# EAGLE design uStar-V2 (EAGLE 9.6.2)
GLOBTEST: v555
Assembly variants: BaseSation, Flight

## Sheet 1 of 2
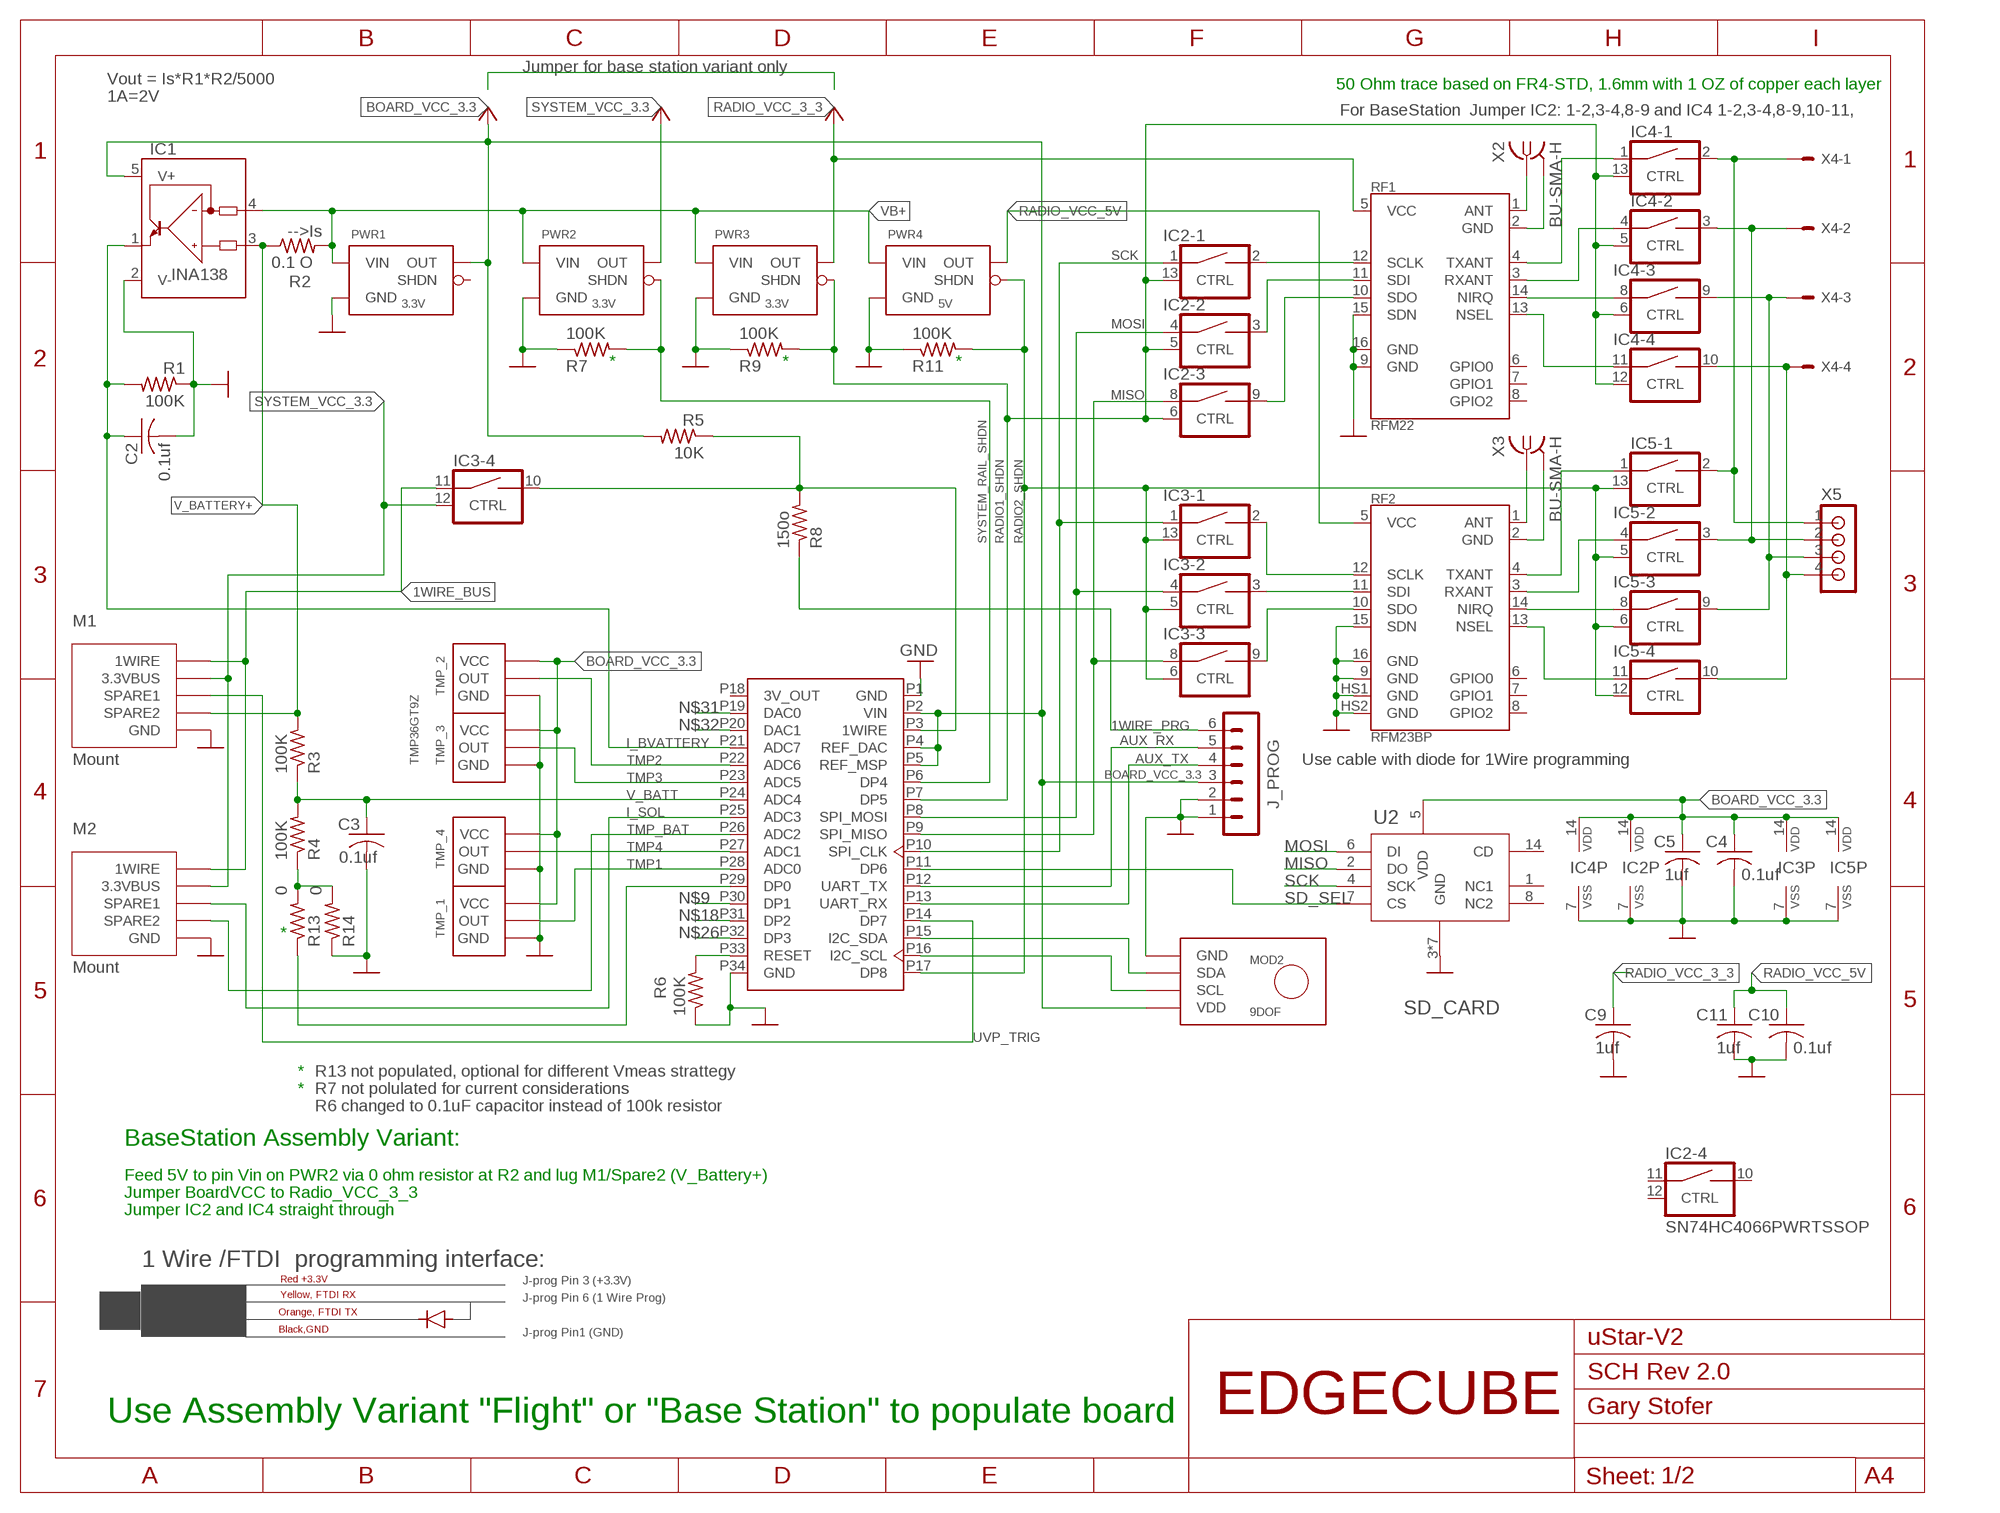
[diagram p0: schematic, sheet 1]
FRAME1 (SSEL_SHEET_A3): AUTHOR: Gary Stofer; DOC_NUMBER-VERSION: SCH Rev 2.0; SHEET_NAME: Main

### Parts
C2  0.1uf  C-USC0805  [C0805]  (not fitted in variant BaseSation)
C3  0.1uf  C-USC0805  [C0805]  (not fitted in variant BaseSation)
C4  0.1uf  C-USC0805  [C0805]
C5  1uf  C-USC0805  [C0805]
C9  1uf  C-USC0805  [C0805]
C10  0.1uf  C-USC0805  [C0805]
C11  1uf  C-USC0805  [C0805]
D1  1N4148DO35-7  [DO35-7]
IC1  INA138  [SOT23-5]  (not fitted in variant BaseSation)
IC2  SN74HC4066PWRTSSOP  [TSSOP14]  (not fitted in variant BaseSation)
IC3  SN74HC4066PWRTSSOP  [TSSOP14]  (not fitted in variant BaseSation)
IC4  SN74HC4066PWRTSSOP  [TSSOP14]  (not fitted in variant BaseSation)
IC5  SN74HC4066PWRTSSOP  [TSSOP14]  (not fitted in variant BaseSation)
J_PROG  90deg header  MA06-190DEG  [MA06-1-90]
M1  Mount  4X8MOUNT  [4X8MOUNT]
M2  Mount  4X8MOUNT  [4X8MOUNT]
MOD1  APP_CORE  [APPCORE_RECEIVER]
MOD2  9DOF  [9DOF]  (not fitted in variant BaseSation)
PWR1  3.3V  S7V8F3_VOLT_REG-3V3_1AUP  [S7V_UP]
PWR2  3.3V  S7V8F3_VOLT_REG-3V3_1AUP  [S7V_UP]  (not fitted in variant BaseSation)
PWR3  3.3V  S7V8F3_VOLT_REG-3V3_1AUP  [S7V_UP]  (not fitted in variant BaseSation)
PWR4  5V  S10V4F5UP  [S10_UP]  (not fitted in variant BaseSation)
R1  100K  R-US_R0805  [R0805]  (not fitted in variant BaseSation)
R2  0.1 O  R-US_R1206W  [R1206W]  (variant BaseSation: 0.0hm)
R3  100K  R-US_R0805  [R0805]  (not fitted in variant BaseSation)
R4  100K  R-US_R0805  [R0805]  (not fitted in variant BaseSation)
R5  10K  R-US_R0805  [R0805]
R6  100K  R-US_R0805  [R0805]  (not fitted in variant BaseSation)  (not fitted in variant Flight)
R7  100K  R-US_R0805  [R0805]  (not fitted in variant BaseSation)  (not fitted in variant Flight)
R8  150o  R-US_R0805  [R0805]
R9  100K  R-US_R0805  [R0805]  (not fitted in variant BaseSation)
R11  100K  R-US_R0805  [R0805]  (not fitted in variant BaseSation)
R13  0  R-US_R0805  [R0805]  (not fitted in variant BaseSation)  (not fitted in variant Flight)
R14  0  R-US_R0805  [R0805]  (not fitted in variant BaseSation)
RF1  RFM22  [RFM22]
RF2  RFM23BP  [RFM23BP]  (not fitted in variant BaseSation)
TMP_1  TMP3P  [TMP3P]  (not fitted in variant BaseSation)
TMP_2  TMP3P  [TMP3P]  (not fitted in variant BaseSation)
TMP_3  TMP36GT9Z  [TO92-INLINE]  (not fitted in variant BaseSation)
TMP_4  TMP3P  [TMP3P]  (not fitted in variant BaseSation)
U2  SD_CARD  503182-1852  [503182-1852_MOL]  (not fitted in variant BaseSation)
X2  BU-SMA-H  [BU-SMA-H]
X3  BU-SMA-H  [BU-SMA-H]  (not fitted in variant BaseSation)
X4  SM04B-SRSS-TB  [SM04B-SRSS-TB]
X5  4-TP  [1X04-1.5MM_JST]

### Nets
1WIRE: IC3.10(-4:B) MOD1.P3(1WIRE) R5.1 R8.2
1WIRE_BUS: IC3.11(-4:A) M1.P$2(1WIRE) M1.P$5(1WIRE) M2.P$2(1WIRE) M2.P$5(1WIRE)
1WIRE_PRG: J_PROG.6 R8.1
AUX_RX: J_PROG.5 MOD1.P12(UART_TX)
AUX_TX: J_PROG.4 MOD1.P13(UART_RX)
BOARD_VCC_3.3: C4.1 C5.1 IC1.5(V+) IC2.14(P:VDD) IC3.14(P:VDD) IC4.14(P:VDD) IC5.14(P:VDD) J_PROG.3 MOD1.P2(VIN) MOD1.P4(REF_DAC) MOD1.P5(REF_MSP) MOD2.VDD PWR1.VOUT(OUT) R5.2 TMP_1.P$3(VCC) TMP_2.P$3(VCC) TMP_3.1(VCC) TMP_4.P$3(VCC) U2.5(VDD) ; supply symbol labelled VCC
GND: C2.2 C3.2 C4.2 C5.2 C9.2 C10.2 C11.2 IC1.2(V-) IC2.7(P:VSS) IC3.7(P:VSS) IC4.7(P:VSS) IC5.7(P:VSS) J_PROG.1 J_PROG.2 M1.P$1(GND) M1.P$8(GND) M2.P$1(GND) M2.P$8(GND) MOD1.P1(GND) MOD1.P34(GND) MOD2.GND PWR1.GND PWR2.GND PWR3.GND PWR4.GND R1.1 R6.1 R7.1 R9.1 R11.1 R14.1 RF1.2(GND) RF1.9(GND) RF1.15(SDN) RF1.16(GND) RF2.2(GND) RF2.9(GND) RF2.15(SDN) RF2.16(GND) RF2.HS1(GND) RF2.HS2(GND) TMP_1.P$1(GND) TMP_2.P$1(GND) TMP_3.3(GND) TMP_4.P$1(GND) U2.3(GND) U2.9(GND) U2.10(GND) U2.11(GND) U2.12(GND) U2.13(GND) U2.15(GND) X2.2 X2.3 X2.4 X2.5 X3.2 X3.3 X3.4 X3.5
I_BVATTERY: C2.1 IC1.1(OUT) MOD1.P21(ADC7) R1.2
I_SOL: M2.P$6(SPARE1) MOD1.P25(ADC3)
MISO: IC2.8(-3:A) IC3.8(-3:A) MOD1.P9(SPI_MISO) U2.2(DO)
MOSI: IC2.4(-2:A) IC3.4(-2:A) MOD1.P8(SPI_MOSI) U2.6(DI)
N$1: MOD1.P16(I2C_SCL) MOD2.SCL
N$2: MOD1.P15(I2C_SDA) MOD2.SDA
N$3: RF1.1(ANT) X2.1
N$5: RF2.1(ANT) X3.1
N$6: IC5.8(-3:A) RF2.14(NIRQ)
N$7: MOD1.P29(DP0) R13.1
N$9: MOD1.P30(DP1)
N$10: IC2.2(-1:B) RF1.12(SCLK)
N$11: IC4.8(-3:A) RF1.14(NIRQ)
N$12: IC2.3(-2:B) RF1.11(SDI)
N$13: IC2.9(-3:B) RF1.10(SDO)
N$14: MOD1.P33(RESET) R6.2
N$15: IC3.2(-1:B) RF2.12(SCLK)
N$16: IC3.3(-2:B) RF2.11(SDI)
N$17: IC3.9(-3:B) RF2.10(SDO)
N$18: MOD1.P31(DP2)
N$19: IC4.9(-3:B) IC5.9(-3:B) X4.3 X5.3
N$20: IC5.11(-4:A) RF2.13(NSEL)
N$21: IC4.4(-2:A) RF1.3(RXANT)
N$22: IC4.10(-4:B) IC5.10(-4:B) X4.4 X5.4
N$23: IC5.1(-1:A) RF2.4(TXANT)
N$24: IC4.3(-2:B) IC5.3(-2:B) X4.2 X5.2
N$25: IC4.2(-1:B) IC5.2(-1:B) X4.1 X5.1
N$26: MOD1.P32(DP3)
N$27: R4.1 R13.2 R14.2
N$31: MOD1.P19(DAC0)
N$32: MOD1.P20(DAC1)
NIRQ: IC4.11(-4:A) RF1.13(NSEL)
RADIO1_SHDN: IC2.5(-2:CTRL) IC2.6(-3:CTRL) IC2.13(-1:CTRL) IC4.5(-2:CTRL) IC4.6(-3:CTRL) IC4.12(-4:CTRL) IC4.13(-1:CTRL) MOD1.P7(DP5) PWR3.SHDN R9.2
RADIO2_SHDN: IC3.5(-2:CTRL) IC3.6(-3:CTRL) IC3.13(-1:CTRL) IC5.5(-2:CTRL) IC5.6(-3:CTRL) IC5.12(-4:CTRL) IC5.13(-1:CTRL) MOD1.P17(DP8) PWR4.SHDN R11.2
RADIO_VCC_3_3: C9.1 PWR3.VOUT(OUT) RF1.5(VCC) ; supply symbol labelled VCC
RADIO_VCC_5V: C10.1 C11.1 PWR4.VOUT(OUT) RF2.5(VCC)
RXANT: IC5.4(-2:A) RF2.3(RXANT)
SCK: IC2.1(-1:A) IC3.1(-1:A) MOD1.P10(SPI_CLK) U2.4(SCK)
SD_SEL: MOD1.P11(DP6) U2.7(CS)
SYSTEM_RAIL_SHDN: MOD1.P6(DP4) PWR2.SHDN R7.2
SYSTEM_VCC_3.3: IC3.12(-4:CTRL) M1.P$4(3.3VBUS) M1.P$7(3.3VBUS) M2.P$4(3.3VBUS) M2.P$7(3.3VBUS) PWR2.VOUT(OUT) ; supply symbol labelled VCC
TMP1: MOD1.P28(ADC0) TMP_1.P$2(OUT)
TMP2: MOD1.P22(ADC6) TMP_2.P$2(OUT)
TMP3: MOD1.P23(ADC5) TMP_3.2(OUT)
TMP4: MOD1.P27(ADC1) TMP_4.P$2(OUT)
TMP_BAT: M2.P$3(SPARE2) MOD1.P26(ADC2)
TXANT: IC4.1(-1:A) RF1.4(TXANT)
UVP_TRIG: M1.P$6(SPARE1) MOD1.P14(DP7)
V_BATT: C3.1 MOD1.P24(ADC4) R3.1 R4.2
V_BATTERY+: IC1.3(IN+) M1.P$3(SPARE2) R2.1 R3.2
VB+: IC1.4(IN-) PWR1.VIN PWR2.VIN PWR3.VIN PWR4.VIN R2.2
Unconnected: D1.A D1.C IC2.10(-4:B) IC2.11(-4:A) IC2.12(-4:CTRL) MOD1.P18(3V_OUT) PWR1.SHDN RF1.6(GPIO0) RF1.7(GPIO1) RF1.8(GPIO2) RF2.6(GPIO0) RF2.7(GPIO1) RF2.8(GPIO2) U2.1(NC1) U2.8(NC2) U2.14(CD)

### Notes on the sheet
- Vout = Is*R1*R2/5000 | Jumper for base station variant only
- 1A=2V | 50 Ohm trace based on FR4-STD, 1.6mm with 1 OZ of copper each layer
- For BaseStation  Jumper IC2: 1-2,3-4,8-9 and IC4 1-2,3-4,8-9,10-11,
- -->Is
- * | * | *
- Use cable with diode for 1Wire programming
- *
- * | R13 not populated, optional for different Vmeas strattegy
- * | R7 not polulated for current considerations
- R6 changed to 0.1uF capacitor instead of 100k resistor
- BaseStation Assembly Variant:
- Feed 5V to pin Vin on PWR2 via 0 ohm resistor at R2 and lug M1/Spare2 (V_Battery+)
- Jumper BoardVCC to Radio_VCC_3_3
- Jumper IC2 and IC4 straight through
- 1 Wire /FTDI  programming interface:
- Red +3.3V | J-prog Pin 3 (+3.3V)
- Yellow, FTDI RX
- J-prog Pin 6 (1 Wire Prog)
- Orange, FTDI TX
- FTDI
- Black,GND
- J-prog Pin1 (GND)
- Use Assembly Variant "Flight" or "Base Station" to populate board

## Sheet 2 of 2
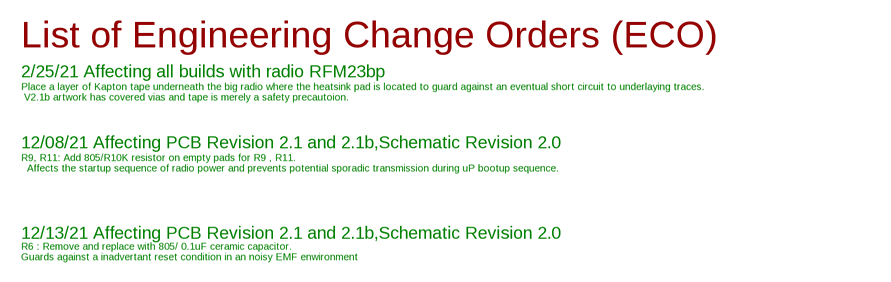
[diagram p1: schematic, sheet 2]

### Notes on the sheet
- List of Engineering Change Orders (ECO)
- 2/25/21 Affecting all builds with radio RFM23bp
- Place a layer of Kapton tape underneath the big radio where the heatsink pad is located to guard against an eventual short circuit to underlaying traces.
   V2.1b artwork has covered vias and tape is merely a safety precautoion.
- 12/08/21 Affecting PCB Revision 2.1 and 2.1b,Schematic Revision 2.0
- R9, R11: Add 805/R10K resistor on empty pads for R9 , R11.
    Affects the startup sequence of radio power and prevents potential sporadic transmission during uP bootup sequence.
- 12/13/21 Affecting PCB Revision 2.1 and 2.1b,Schematic Revision 2.0
- R6 : Remove and replace with 805/ 0.1uF ceramic capacitor.
  Guards against a inadvertant reset condition in an noisy EMF enwironment

## Library data of the parts
C2 C4 C10 = rcl:C-US: CAPACITOR, American symbol; DIGIKEY: 1276-1099-1-ND; SPICEPREFIX: C
C3 C5 C9 C11 = rcl:C-US: CAPACITOR, American symbol; DIGIKEY: 311-3497-1-ND; SPICEPREFIX: C
D1 = diode:1N4148: DIODE high speed (Philips)
IC1 = newUstar:INA138: High-Side Measurement Current Shunt Monitor; DIGIKEY: 296-17936-2-ND; MF: TEXAS INSTRUMENTS; MPN: INA138NA/250; OC_FARNELL: 1564888; OC_NEWARK: 80K5906
IC2-IC5 = newUstar:SN74HC4066PWR: Quad bilateral ANALOG SWITCH; DIGIKEY: 296-8330-1-ND
J_PROG = newUstar:MA06-1: PIN HEADER; DIGIKEY: 2057-PH1R8-06-UA-ND
M1 M2 = newUstar:4X8MOUNT: 4x8 MOUNT for EDGEQUBE; NO_PN: Hole pattern template
MOD1 = newUstar:APP_CORE; DIGIKEY: S7050-ND Two times; DIGIKEY2: ED4564-17-ND Two times
MOD2 = newUstar:9DOF: Sparkfun part no: SEN-13944, Accel,Rate,Magnetometer; DIGIKEY: 1568-1424-ND; SPARKFUN: SEN-13944
PWR1-PWR3 = newUstar:S7V8F3_VOLT_REG-3V3_1A; DIGIKEY: 2183-2122-ND
PWR4 = newUstar:S10V4F5; DIGIKEY: 2183-2121-ND
R1 R3 R4 R6 R7 R9 R11 = rcl:R-US_: RESISTOR, American symbol; DIGIKEY: 2019-RK73H2ATTD1003FCT-ND; SPICEPREFIX: R
R2 = rcl:R-US_: RESISTOR, American symbol; DIGIKEY: CSR1206FTR100CT-ND; SPICEPREFIX: R
R5 = rcl:R-US_: RESISTOR, American symbol; DIGIKEY: 311-10.0KCRCT-ND; SPICEPREFIX: R
R8 = rcl:R-US_: RESISTOR, American symbol; DIGIKEY: 2019-RK73H2ATTD1200FCT-ND; SPICEPREFIX: R
R13 R14 = rcl:R-US_: RESISTOR, American symbol; DIGIKEY: 311-0.0ARCT-ND; SPICEPREFIX: R
RF1 = newUstar:RFM22; HOPERF: RFM22
RF2 = newUstar:RFM23BP: RFM22BP 1W 433MHz Transceiver; FREQUENCY: 433 MHz; HOPERF: RFM23BP; MANF-PN: RFM23BP; MANUFACTURER: HOPERF Electronic
TMP_1 TMP_4 = newUstar:TMP3P: TMP Sensor Wire Connection
TMP_2 = newUstar:TMP3P: TMP Sensor Wire Connection; DIGIKEY: TMP36GT9Z-ND
TMP_3 = newUstar:TMP36GT9Z; DIGIKEY: TMP36GT9Z-ND
U2 = newUstar:503182-1852; DIGIKEY: WM12834CT; MOLEX_PN: 503182-1852
X2 X3 = newUstar:BU-SMA-H: FEMALE SMA CONNECTOR Radiall; DIGIKEY: WM4088-ND; OC_FARNELL: unknown; OC_NEWARK: unknown
X4 = newUstar:?M04B-SRSS-TB: Disconnectable Crimp style connector, 1.0mm pitch 4 contacts; DIGIKEY: 455-1804-1-ND
X5 = newUstar:4-TP

## Board
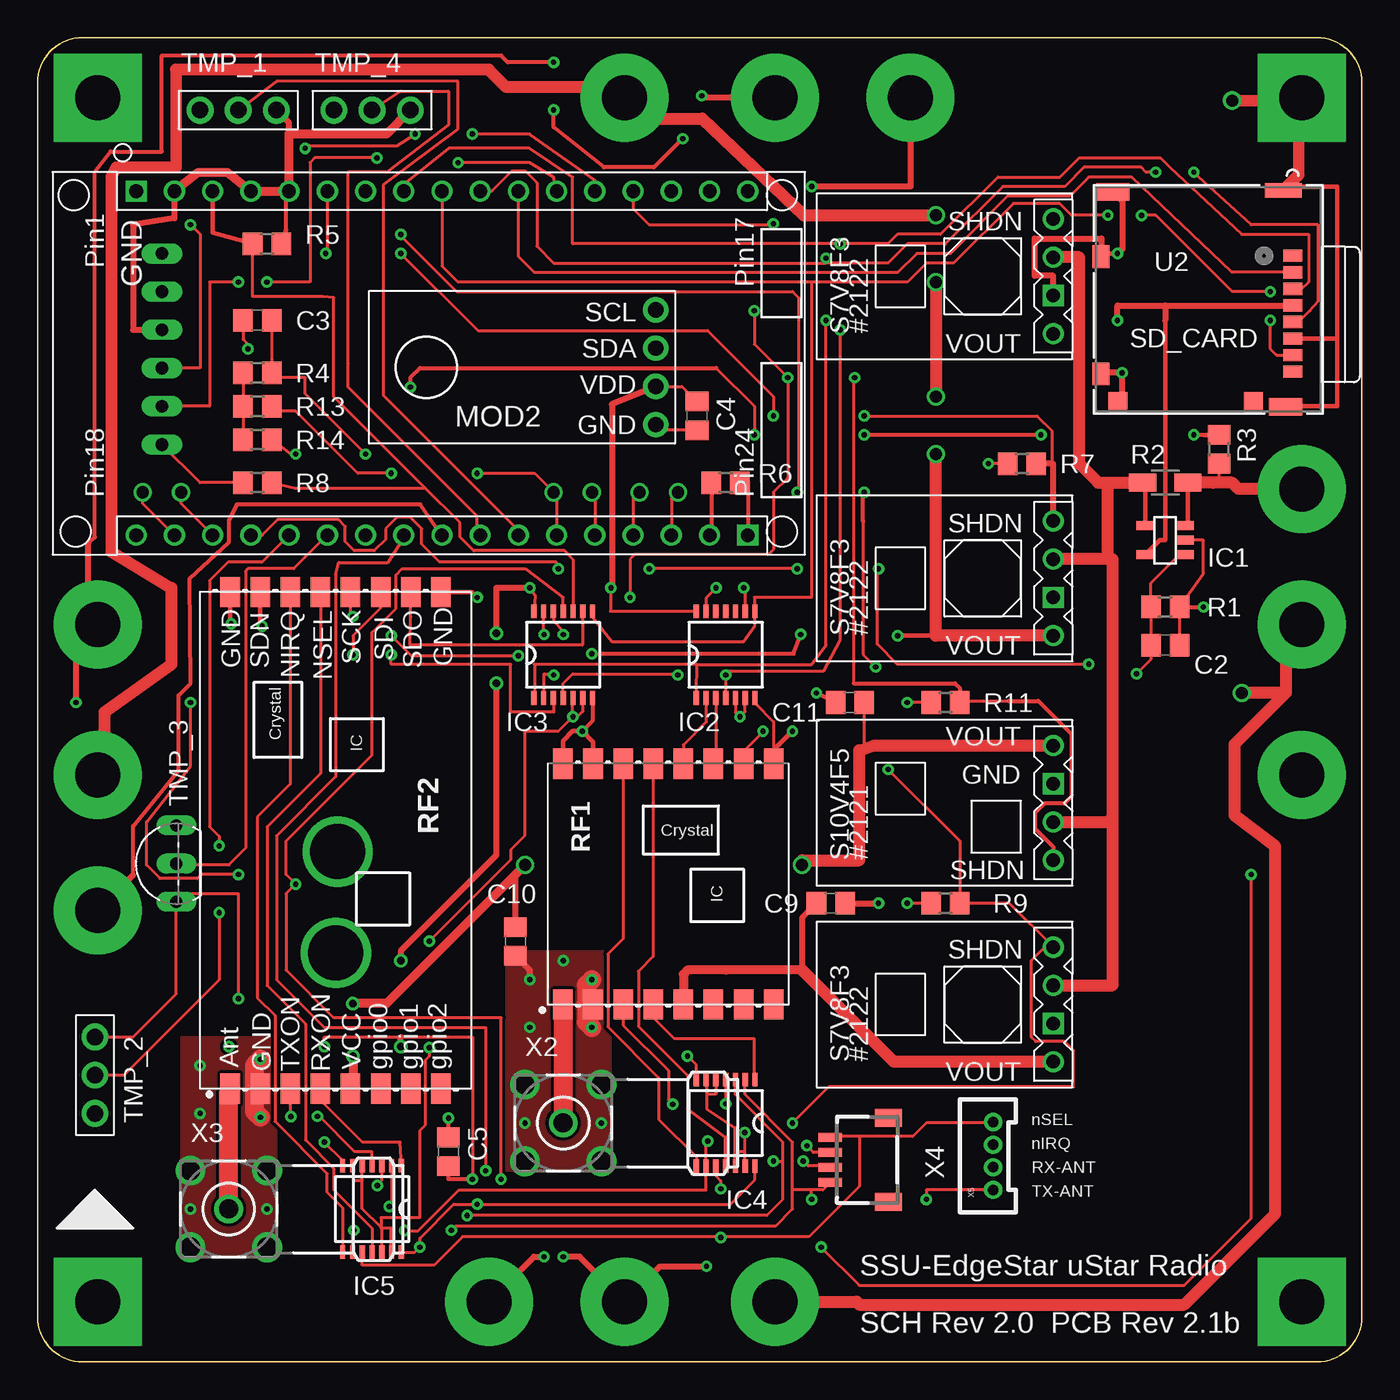
[diagram p2: board, top side]
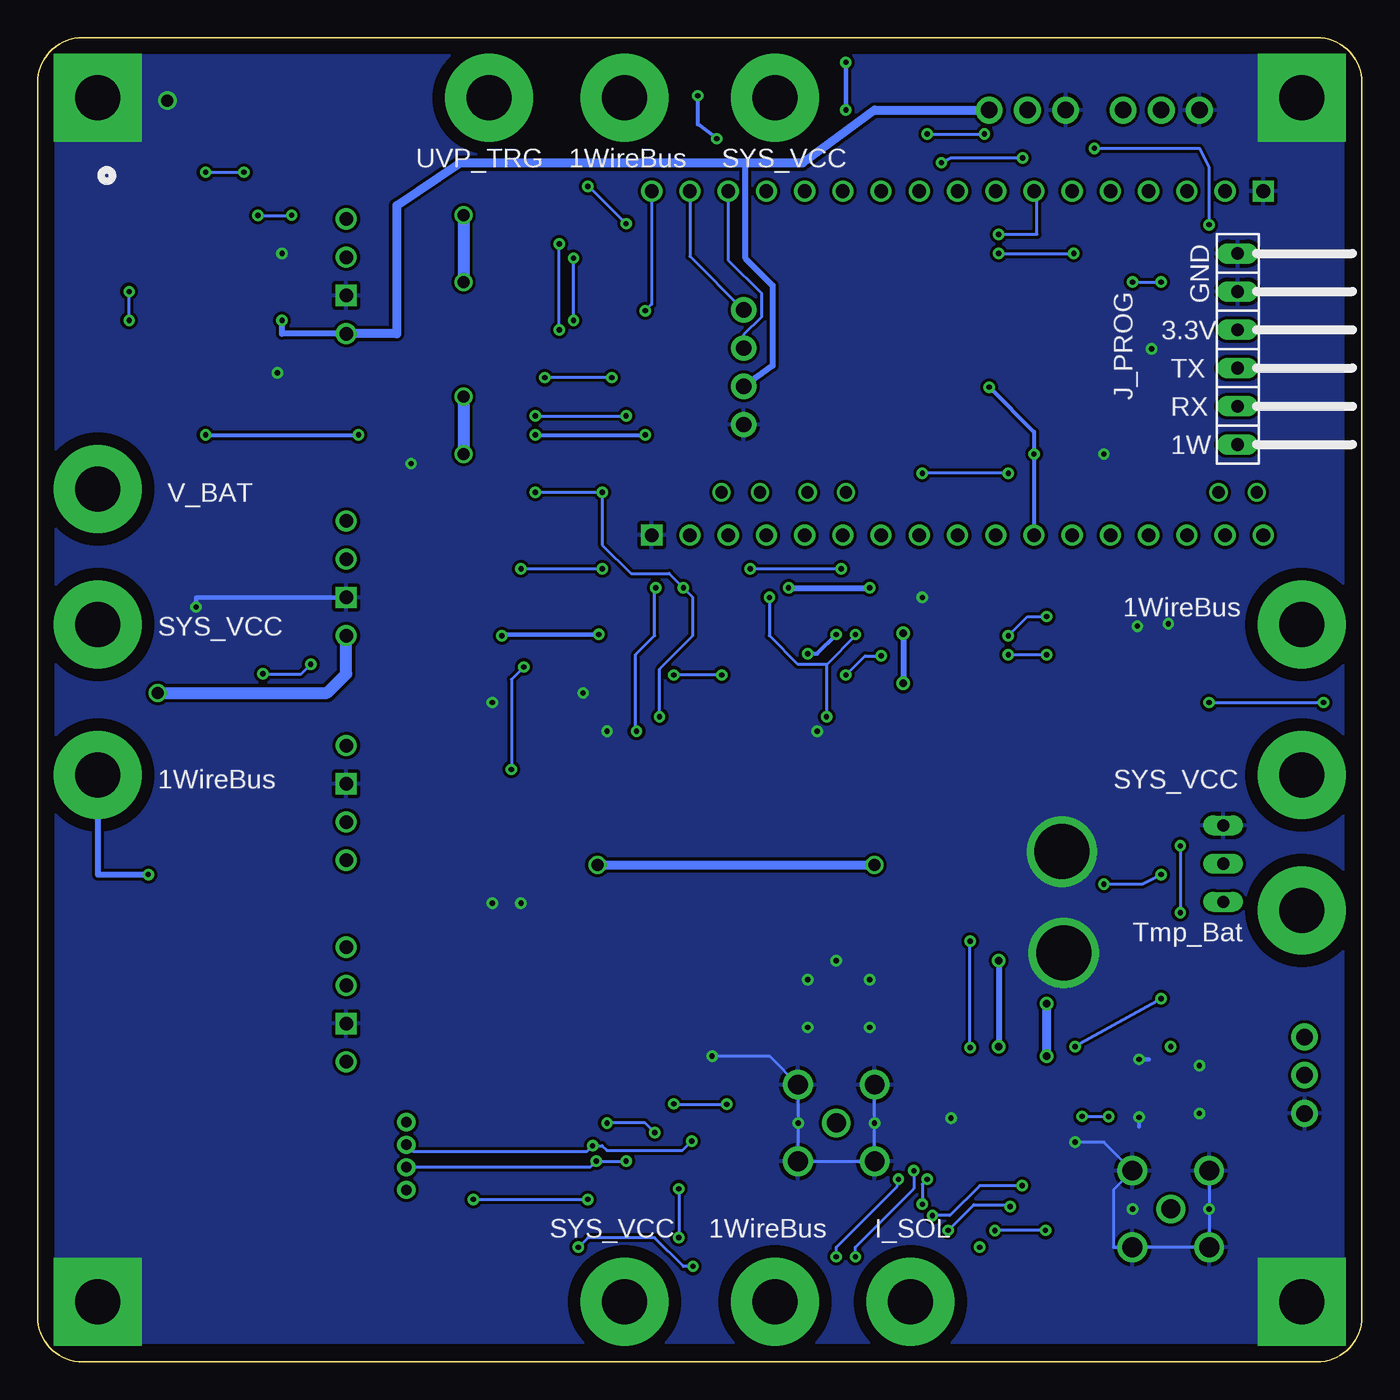
[diagram p3: board, bottom side, seen from below]

Size 88 x 88 mm. Coordinates in mm from the lower left corner, seen from the top.
Copper layers (1*16): Top 0.035mm / dielectric 1.5mm / Bottom 0.035mm
Design rules "default *": minimum track width 8mil, minimum drill 0.35mm, track to track 8mil, track to pad 9mil, pad to pad 9mil, via to via 9mil, smd to smd 6mil, copper to edge 40mil, drill to drill 6mil, minimum pad ring 10mil, minimum via ring 8mil, stop-mask expansion 4mil, vias tented up to drill 20mil, thermal gap 10mil

### Footprints (pad centres in the part's own frame; a part is rotated, then mirrored left to right if it is on the bottom)
C0805 = smd 1.3 x 1.5: 1 -0.95,0; 2 0.95,0
DO35-7 = drill 0.813 long: A 3.81,0; C -3.81,0
SOT23-5 = smd 0.6 x 1.2: 1 -0.95,-1.306; 2 0,-1.306; 3 0.95,-1.306; 4 0.95,1.306; 5 -0.95,1.306
TSSOP14 = smd 0.9 x 0.35: 1 -2.875,1.95; 2 -2.875,1.3; 3 -2.875,0.65; 4 -2.875,0; 5 -2.875,-0.65; 6 -2.875,-1.3; 7 -2.875,-1.95; 8 2.875,-1.95; 9 2.875,-1.3; 10 2.875,-0.65; 11 2.875,0; 12 2.875,0.65; 13 2.875,1.3; 14 2.875,1.95
MA06-1-90 = drill 0.85 long: 1 -6.35,0; 2 -3.81,0; 3 -1.27,0; 4 1.27,0; 5 3.81,0; 6 6.35,0
4X8MOUNT = drill 3 pad 5.85 square: P$1 84,4; P$8 4,4 | drill 3 pad 5.85: P$2 83.998,39; P$3 4,30; P$4 49,4; P$5 39,4; P$6 30,4; P$7 4,39
APPCORE_RECEIVER = drill 0.9 square: P1 11.43,19.45; P34 -11.43,-21.19 | drill 0.9: P2 11.43,16.91; P3 11.43,14.37; P4 11.43,11.83; P5 11.43,9.29; P6 11.43,6.75; P7 11.43,4.21; P8 11.43,1.67; P9 11.43,-0.87; P10 11.43,-3.41; P11 11.43,-5.95; P12 11.43,-8.49; P13 11.43,-11.03; P14 11.43,-13.57; P15 11.43,-16.11; P16 11.43,-18.65; P17 11.43,-21.19; P18 -11.43,19.45; P19 -11.43,16.91; P20 -11.43,14.37; P21 -11.43,11.83; P22 -11.43,9.29; P23 -11.43,6.75; P24 -11.43,4.21; P25 -11.43,1.67; P26 -11.43,-0.87; P27 -11.43,-3.41; P28 -11.43,-5.95; P29 -11.43,-8.49; P30 -11.43,-11.03; P31 -11.43,-13.57; P32 -11.43,-16.11; P33 -11.43,-18.65
9DOF = drill 1.016 pad 1.676: GND -7.62,3.81; SCL -7.62,-3.81; SDA -7.62,-1.27; VDD -7.62,1.27
S7V_UP = drill 0.9 square: GND -1.27,-7.23 | drill 0.9: SHDN 3.81,-7.23; VIN 1.27,-7.23; VOUT -3.81,-7.23
S10_UP = drill 0.9 square: GND 1.27,-7.23 | drill 0.9: SHDN -3.81,-7.23; VIN -1.27,-7.23; VOUT 3.81,-7.23
R0805 = smd 1.3 x 1.5: 1 -0.95,0; 2 0.95,0
R1206W = smd 1.8 x 1.2: 1 -1.499,0; 2 1.499,0
RFM22 = smd 2 x 1.3: 1 -8,7; 2 -8,5; 3 -8,3; 4 -8,1; 5 -8,-1; 6 -8,-3; 7 -8,-5; 8 -8,-7; 9 8,-7; 10 8,-5; 11 8,-3; 12 8,-1; 13 8,1; 14 8,3; 15 8,5; 16 8,7
RFM23BP = smd 2 x 1.3: 1 -12.319,6.888; 2 -12.319,4.888; 3 -12.319,2.888; 4 -12.319,0.888; 5 -12.319,-1.112; 6 -12.319,-3.112; 7 -12.319,-5.112; 8 -12.319,-7.112; 9 20.681,-7.112; 10 20.681,-5.112; 11 20.681,-3.112; 12 20.681,-1.112; 13 20.681,0.888; 14 20.681,2.888; 15 20.681,4.888; 16 20.681,6.888 | drill 3.658: HS1 -3.302,-0.127; HS2 3.429,-0.254
TMP3P = drill 1.1 pad 1.778: P$1 0,0; P$2 2.54,0; P$3 5.08,0
TO92-INLINE = drill 0.813 long: 1 -2.54,0; 2 0,0; 3 2.54,0
503182-1852_MOL = smd 0.813 x 1.245: 1 5.315,4.668; 2 4.215,4.668; 3 3.115,4.668; 4 2.015,4.668; 5 0.915,4.668; 6 -0.185,4.668; 7 -1.285,4.668; 8 -2.385,4.668 | smd 1.499 x 1.143: 9 -2.325,-8.087; 10 5.455,-8.087 | smd 0.94 x 2.489: 11 -6.73,4.038 | smd 1.143 x 2.21: 12 7.66,4.188; 13 -6.63,-7.292 | smd 1.168 x 1.245: 14 7.255,2.038; 15 7.255,-6.962
BU-SMA-H = drill 1.27: 1 0,0 | drill 1.321: 2 -2.55,2.55; 3 2.55,2.55; 4 2.55,-2.55; 5 -2.55,-2.55
SM04B-SRSS-TB = smd 0.6 x 1.55: 1 -1.5,2.975; 2 -0.5,2.975; 3 0.5,2.975; 4 1.5,2.975 | smd 1.2 x 1.8: FIT@1 -2.8,-0.9; FIT@2 2.8,-0.9
1X04-1.5MM_JST = drill 0.7: 1 0,0; 2 1.5,0; 3 3,0; 4 4.5,0

### Placement (x,y rotation side)
C2  74.93,47.62 0 top
C3  14.61,69.22 180 top
C4  43.81,62.87 270 top
C5  27.3,13.97 90 top
C9  52.7,30.48 0 top
C10  31.75,27.94 270 top
C11  53.98,43.81 180 top
D1  5.08,-12.7 0 top  (outside the outline)
IC1  74.93,54.61 90 top
IC2  45.72,46.99 90 top
IC3  34.92,46.99 90 top
IC4  45.72,15.88 270 top
IC5  22.23,10.16 270 top
J_PROG  8.26,67.31 270 bottom
M1  88,88 180 top
M2  0,0 0 top
MOD1  26,66.36 90 top
MOD2  33.46,66.09 180 top
PWR1  60.26,72.14 90 top
PWR2  60.26,52.07 90 top
PWR3  60.26,23.75 90 top
PWR4  60.26,37.15 90 top
R1  74.93,50.16 180 top
R2  74.93,58.42 180 top
R3  78.51,60.64 270 top
R4  14.61,65.72 0 top
R5  15.24,74.3 0 top
R6  45.72,58.42 180 top  (not fitted)
R7  65.41,59.69 0 top  (not fitted)
R8  14.61,58.42 0 top
R9  60.33,30.48 0 top
R11  60.33,43.81 0 top
R13  14.61,63.5 180 top  (not fitted)
R14  14.61,61.28 180 top
RF1  41.91,31.75 90 top
RF2  19.68,30.48 90 top
TMP_1  10.79,83.19 0 top
TMP_2  3.81,16.51 90 top
TMP_3  9.22,33.11 90 top
TMP_4  19.68,83.19 0 top
U2  78.74,71.12 270 top
U$1  [PCBOUTLINE]  0,0 0 top
X2  34.92,15.88 0 top
X3  12.7,10.16 0 top
X4  55.65,13.42 90 top
X5  63.5,11.43 90 top

### Tracks (layer width: path | path; a pad name or v marks a point on that pad's centre or on a via)
1WIRE
  Top 0.203: IC3.10 35.58,53.33 35,53.9 28.98,53.9 28.06,54.82 28.06,55.76 25.72,58.1 | 25.72,58.1 19.68,64.14 19.68,70.72 18.96,70.8 14.29,70.8 R5.1 | R8.2 17.1,58.06 25.68,58.06 25.72,58.1
  Top 0.305: R5.1 11.63,75.05 MOD1.P3
1WIRE_BUS  (via drill 0.35)
  Top 0.203: v30.8,12.14 30.8,22.86 19.68,22.86 16.51,26.04 16.51,31.11 v17.14,31.75 16.51,32.38 16.51,34.61 22.23,40.32 22.23,48.47 23.82,50.06 23.82,52.3 24.22,52.7 32.38,52.7 34.92,50.8 IC3.11 | v10.16,43.81 10.16,39.61 7.25,35.88 7.25,33.02 8.14,32.12 10.6,32.12 10.87,32.38 v13.34,32.38 | v52.07,7.62 54.61,5.08 76.2,5.08 80.64,9.53 v80.64,32.38
  Top 0.254: 3.37,54.42 3.81,54.8 3.81,79.07 4.85,80.43 8.26,80.43 8.26,86.81 30.8,86.81 31.24,86.36 v34.29,86.36 | v42.86,81.28 40.96,79.38 37.62,79.38 34.29,82.04 v34.29,83.19
  Top 0.406: M1.P$5 44.13,84 v44.13,84.14 | v34.92,6.99 36.02,6.99 M2.P$5 41.35,6.35 v44.45,6.35 | v2.54,43.81 2.54,47.54 M1.P$2 3.37,49.63 3.37,54.42
  Bottom 0.203: v34.92,6.99 34.92,7.62 30.87,11.67 v30.8,12.14 | v17.14,31.75 14.61,31.75 v13.34,32.38 | v10.16,43.81 v2.54,43.81 | v44.45,6.35 45.09,6.35 46.99,8.26 51.44,8.26 v52.07,7.62
  Bottom 0.254: v42.86,81.28 44.13,82.23 v44.13,84.14
  Bottom 0.305: v34.29,83.19 v34.29,86.36
  Bottom 0.406: M2.P$2 84,32.38 v80.64,32.38
1WIRE_PRG
  Top 0.203: R8.1 10.79,58.42 J_PROG.6
AUX_RX  (via drill 0.35)
  Top 0.203: MOD1.P12 34.29,78.74 32.7,79.69 v27.94,79.69 | v22.54,80.01 18.41,80.01 18.1,79.69 18.1,71.75 v15.24,71.75 | v13.34,71.75 11.43,71.75 11.43,63.5 J_PROG.5
  Bottom 0.203: v27.94,79.69 27.3,80.01 v22.54,80.01 | v15.24,71.75 v13.34,71.75
AUX_TX  (via drill 0.35)
  Top 0.203: MOD1.P13 37.03,78.54 32.7,81.6 v28.89,81.6 | v17.78,80.64 18.1,80.8 23.89,80.8 v25.08,81.6 | v10.16,75.56 10.79,74.93 10.79,66.04 J_PROG.4
  Bottom 0.203: v28.89,81.6 v25.08,81.6 | v17.78,80.64 10.79,80.64 10.16,79.38 v10.16,75.56
BOARD_VCC_3.3  (via drill 0.35, 0.5)
  Top 0.203: TMP_2.P$3 6.35,21.59 9.22,24.46 TMP_3.1 9.3,31.11 13.34,31.11 v13.34,24.13 | v19.05,20.95 19.05,21.59 24.13,21.59 28.89,21.59 v28.89,12.14 | IC4.14 47.67,12.11 46.04,10.48 v29.21,10.48 27.65,10.48 25.4,8.23 v25.4,7.62 25.07,7.29 IC5.14 | MOD2.VDD 42.8,64.83 C4.1 | v32.7,51.44 33.05,50.95 IC3.14 | v38.1,51.44 38.05,51.39 38.05,49.87 IC2.14
  Top 0.254: 16.51,75.25 16.51,77.8 | v28.89,12.14 27.3,12.14 C5.1
  Top 0.305: IC1.5 74.57,54.61 74.93,54.61 74.93,69.22 | R5.2 16.51,75.25
  Top 0.406: 74.93,70.2 71.75,70.2 v71.75,69.22 | 74.93,70.2 U2.5 | 74.93,70.2 74.93,69.22 | 16.51,77.8 MOD1.P5 | 16.71,81.6 16.71,82.35 TMP_1.P$3 | MOD1.P2 9.09,76 6.35,75.56 6.35,68.58 J_PROG.3 | MOD2.VDD 38.17,63.63 38.17,51.37 v38.1,51.44 | v32.7,51.44 30.48,51.44 v30.48,48.41 | v24.13,26.67 24.13,27.3 30.48,33.66 v30.48,45.09 | v24.13,20.95 24.13,21.59
  Top 0.61: MOD1.P2 10.67,79.06 12.59,79.06 MOD1.P4 16.51,77.8 | MOD1.P5 16.71,81.6 23.18,81.6 TMP_4.P$3
  Bottom 0.203: v13.34,24.13 v19.05,20.95 | v28.89,12.14 29.21,11.82 v29.21,10.48
  Bottom 0.406: 40.96,79.67 40.96,73.32 39.16,71.52 39.16,66.2 MOD2.VDD | v30.48,48.41 v30.48,45.09 | v24.13,26.67 v24.13,20.95 | PWR1.VOUT 71.75,68.33 v71.75,69.22 | v38.1,51.44 v32.7,51.44
  Bottom 0.61: TMP_4.P$3 32.38,83.19 37.17,79.67 40.96,79.67 59.96,79.67 64.14,76.83 64.14,68.33 PWR1.VOUT
GND  (via drill 0.35, 0.8)
  Top 0.203: IC4.7 43.77,19.73 v43.18,20.32 | IC1.2 77.47,54.61 77.47,52.39 R1.1 C2.2 | C4.2 41.45,61.91 MOD2.GND | IC2.7 47.67,43.77 48.91,42.53 RF1.9 | IC5.7 20.27,13.38 v19.05,14.61 | R9.1 v57.78,30.48 | R11.1 v57.78,43.81 | R7.1 v63.18,59.69 | C3.2 13.65,67.95 13.97,67.63 v13.97,67.31 | 36.83,23.5 36.83,23.75 | R14.1 16.82,60.33 v17.14,60.33
  Top 0.254: R6.1 47.19,58.53 MOD1.P34 | C11.2 v51.75,44.45 | C5.2 v27.3,16.19 | R1.1 v77.47,50.16 | IC3.7 36.88,42.59 v36.2,41.91
  Top 0.305: U2.11 82.78,78.11 86.36,78.11 86.36,67.94 | U2.12 82.97,63.5 86.36,63.5 86.36,67.94 | U2.3 86.3,68 86.36,67.94 | U2.9 70.87,73.66 v71.75,73.66 | RF2.9 28.85,51.16 v29.21,50.8 | RF1.9 48.91,40.66 v50.16,41.91 | RF2.16 12.8,49.12 v12.86,49.05 | RF2.15 14.8,49.02 v14.92,48.9 | RF1.16 34.91,41.26 35.56,41.91 v36.2,41.91 36.91,41.2 RF1.15
  Top 0.406: U2.15 72.07,64.16 v72.07,65.72 70.71,65.72 U2.10 | v71.75,73.66 71.78,73.66 72.08,73.97 72.08,77.11 U2.13 | C9.2 v55.88,30.48 | C10.2 32.7,26.04 v32.7,25.4 | PWR1.GND 67.49,72.17 66.25,72.17 66.25,74.64 70.69,74.64 70.69,73.66 70.87,73.66 | RF1.2 36.83,23.75
  Top 0.762: M1.P$8 83.82,83.82 | 83.82,83.82 v79.38,83.82 | U2.11 83.82,78.89 83.82,83.82
  Top 1.27: 36.47,23.85 36.47,22.58 v36.83,22.23 | 36.47,23.85 36.47,25.04 v36.83,25.4 | 36.47,23.85 36.83,23.5 | 14.4,18.56 14.4,16.66 v14.81,16.26 | v14.81,20.1 14.4,19.7 14.4,18.56 | RF2.2 14.4,18.56
  Bottom 0.203: X3.2 X3.5 X3.4 16.51,7.61 16.51,11.45 X3.3 17.14,14.61 v19.05,14.61 | X2.2 X2.5 X2.4 X2.3 39.37,20.32 v43.18,20.32
  Bottom 0.254: v14.81,16.26 14.81,15.62
  Bottom 0.305: v14.81,20.1 14.17,20.1 | v77.47,50.16 77.47,50.8 PWR2.GND
  other vias: 10.79,19.68 10.79,16.51 10.16,10.16 15.24,10.16 32.38,15.88 37.47,15.88 32.7,22.23 34.92,26.67
  pour Bottom: 1.27,1.27 87,1.27 87,87 1.27,87
  pour Top (no thermals): 31.11,12.7 38.1,12.7 38.1,27.3 31.11,27.3
  pour Top (no thermals): 9.53,6.99 15.88,6.99 15.88,21.59 9.53,21.59
I_BVATTERY  (via drill 0.35)
  Top 0.203: IC1.1 75.89,53.66 73.98,51.76 R1.2 C2.1 73.98,46.67 v73.03,45.72 | MOD1.P21 14.93,54.94 15.96,55.97 20,55.97 20.44,55.52 20.44,54.5 21.04,53.9 22.38,53.9 23.14,54.66 23.14,55.36 23.9,56.13 24.76,56.13 25.52,55.36 25.52,54.34 26.71,53.16 34.45,53.16 34.57,53.03 34.57,52.74 v34.61,52.7 | v69.85,46.35 57.15,46.35 55.81,47.7 55.81,52.63 v55.88,52.7 | v50.48,52.7 v40.64,52.7
  Bottom 0.203: v40.64,52.7 v34.61,52.7 | v73.03,45.72 70.48,45.72 v69.85,46.35 | v55.88,52.7 v50.48,52.7
I_SOL  (via drill 0.35)
  Top 0.203: MOD1.P25 24.45,54.94 23.28,53.13 20.01,53.13 19.82,52.3 19.82,38.89 15.88,34.95 15.88,25.4 19.05,22.23 29.77,22.23 v29.77,12.7
  Top 0.406: M2.P$6 32.98,6.99 v33.66,6.99
  Bottom 0.203: v33.66,6.99 33.66,7.62 29.77,11.5 v29.77,12.7
MISO  (via drill 0.35)
  Top 0.203: 51.44,71.75 57.78,71.75 59.05,73.03 60.87,73.03 64.83,76.98 67.92,76.98 68.7,76.2 v71.12,76.2 | 51.44,71.75 27.94,71.75 26.87,72.83 MOD1.P9 | IC3.8 36.88,49.48 38.17,47.87 46.92,47.87 47.67,48.94 47.67,49.53 | 47.67,49.53 IC2.8 | 51.44,71.75 51.44,50.8 47.62,50.8 47.62,49.58 47.67,49.53 | v81.92,69.22 81.92,67.31 82.32,66.91 U2.2 | v81.92,71.12 79.38,71.12 74.3,76.2 73.39,76.2 v73.36,76.18
  Bottom 0.203: v81.92,69.22 v81.92,71.12 | v73.36,76.18 71.14,76.18 v71.12,76.2
MOSI  (via drill 0.35)
  Top 0.203: U2.6 84,71.31 84.45,71.75 84.45,74.93 80.01,74.93 75.25,79.38 74.61,80.01 69.22,80.01 67.94,78.74 63.82,78.74 60.01,74.93 57.15,74.93 56.52,74.3 v53.34,74.3 35.56,74.3 35.56,78.74 32.7,80.64 27.3,80.64 24.13,78.11 MOD1.P8 | IC3.4 34.92,45.09 35.56,45.72 42.55,45.72 v42.55,45.65 | IC2.4 v45.72,45.65 46,45.92 52.25,45.92 53.34,47.97 v53.34,68.58
  Bottom 0.203: v42.55,45.65 | v42.55,45.65 v45.72,45.65 | v53.34,68.58 v53.34,74.3
N$1
  Bottom 0.203: MOD1.P16 44.65,73.47 MOD2.SCL
N$2
  Bottom 0.203: MOD1.P15 42.11,73.22 39.91,71.03 39.91,69.42 41.08,68.25 MOD2.SDA
N$3
  Top 0.203: RF1.1 34.91,23.29
  Top 1.27: 34.91,23.29 arc45 34.92,23.26 X2.1
N$5
  Top 1.27: X3.1 12.7,17.93 arc-45 RF2.1
N$6
  Top 0.203: IC5.8 20.27,10.23 19.25,11.25 19.25,12.5 15.78,15.97 15.78,23.02 14.61,24.19 14.61,36.2 16.8,38.39 RF2.14
N$7  (via drill 0.35, 0.8)
  Top 0.203: MOD1.P29 34.49,57.59 v34.29,57.78 33.02,59.05 v29.21,59.05 | v23.5,59.05 21.27,59.05 17.14,63.18 15.87,63.18 R13.1
  Bottom 0.203: v23.5,59.05 v29.21,59.05
N$9  (via drill 0.8)
  Top 0.203: v36.83,57.78 37.03,57.59 MOD1.P30
N$10
  Top 0.203: IC2.2 44.42,42.52 42.91,41.01 RF1.12
N$11
  Top 0.203: RF1.14 38.91,28.11 37.89,27.09 37.89,22.27 41.27,18.88 41.27,16.13 43.77,13.63 IC4.8
N$12
  Top 0.203: IC2.3 45.07,39.91 RF1.11
N$13  (via drill 0.35)
  Top 0.203: RF1.10 46.91,40.56 48.26,41.91 v48.2,41.91 | v46.92,51.44 47.02,51.33 IC2.9
  Bottom 0.203: v48.2,41.91 48.26,41.97 48.26,46.99 46.99,48.26 46.99,51.44 v46.92,51.44
N$14
  Top 0.254: R6.2 44.77,55.05 MOD1.P33
N$15  (via drill 0.35)
  Top 0.203: IC3.2 33.66,44.15 33.66,45.72 34.22,45.72 v34.29,45.65 | v31.95,46.92 24.84,46.92 v23.5,48.26 | v20.95,49.53 20.8,49.69 RF2.12
  Bottom 0.203: v23.5,48.26 22.23,49.53 v20.95,49.53 | v34.29,45.65 33.02,46.92 v31.95,46.92
N$16  (via drill 0.35)
  Top 0.203: IC3.3 34.29,44.1 34.29,43.18 31.43,43.18 31.43,46.35 23.5,46.35 v23.5,46.99 | RF2.11 22.8,50.1 20.95,48.26 v20.95,46.99
  Bottom 0.203: v23.5,46.99 v20.95,46.99
N$17
  Top 0.203: RF2.10 24.8,49.5 24.77,47.62 31.75,47.62 32.02,47.62 36.2,47.62 36.23,47.66 IC3.9
N$18  (via drill 0.8)
  Top 0.203: v40.01,57.78 39.57,57.35 MOD1.P31
N$19  (via drill 0.35)
  Top 0.203: IC5.9 20.93,8.74 v21.03,8.74 | v24.39,8.72 25.29,8.72 27.99,11.43 44.42,11.43 IC4.9 44.42,14.57 v44.52,14.68 | X4.3 51.56,13.92 v51.12,14.36
  Bottom 0.203: v21.03,8.74 24.39,8.74 v24.39,8.72 | v44.52,14.68 45.16,14.04 50.16,14.04 50.48,14.36 v51.12,14.36 51.51,13.97 63.04,13.97 X5.3
N$20
  Top 0.203: RF2.13 18.8,39.12 15.24,35.56 15.24,25.01 17.8,22.45 17.8,14.74 19.68,12.85 19.68,11.43 22.23,8.89 IC5.11
N$21  (via drill 0.35)
  Top 0.203: RF1.3 38.91,22.37 41.91,19.37 41.91,17.42 v42.21,17.12 | IC4.4 v45.72,17.14
  Bottom 0.203: v45.72,17.14 45.72,17.12 v42.21,17.12
N$22  (via drill 0.35)
  Top 0.203: IC4.10 45.07,12.37 45.39,12.05 v45.39,11.5 | 54.61,14.98 52.73,14.98 X4.4 | 54.61,14.98 54.61,11.68 51.24,8.31 45.4,8.31 | 45.4,8.31 28.22,8.31 26.35,6.43 21.57,6.43 IC5.10 | v45.4,8.26 45.4,8.31 | X5.4 63.45,15.88 59.05,15.88 58.16,14.98 54.61,14.98
  Bottom 0.203: v45.39,11.5 45.39,8.27 v45.4,8.26
N$23
  Top 0.203: RF2.4 18.8,18.03 19.05,17.14 21.59,14.61 24.1,14.61 IC5.1
N$24  (via drill 0.35)
  Top 0.203: IC5.3 22.88,12.08 22.58,11.78 v22.58,11.71 | 49.53,13.34 49.53,10.79 48.46,9.73 v28.54,9.73 | 49.53,13.34 49.53,14.61 46.37,17.77 IC4.3 | X4.2 52.58,13.02 51.19,13.02 v50.87,13.34 | v48.9,13.34 49.53,13.34
  Bottom 0.203: v22.58,11.71 25.4,11.71 27.38,9.73 v28.54,9.73 | v48.9,13.34 v50.87,13.34 51.28,12.93 X5.2
N$25  (via drill 0.35)
  Top 0.203: IC5.2 23.52,10.47 v23.37,10.32 | IC4.2 46.99,18.72 46.99,17.78 50.16,14.61 50.16,11.43 | 50.16,11.43 50.16,10.16 49.02,9.02 27.77,9.02 v27.49,8.74 | X4.1 52.18,11.43 51.44,11.43 | 51.44,11.43 50.16,11.43 | X5.1 59.05,11.43 v59.05,10.79 | v51.44,10.79 51.44,11.43
  Bottom 0.203: v23.37,10.32 23.49,10.44 25.8,10.44 v27.49,8.74 | v59.05,10.79 v51.44,10.79
N$26  (via drill 0.8)
  Top 0.203: v42.55,57.78 42.11,57.35 MOD1.P32
N$27
  Top 0.203: R4.1 R13.2 R14.2
N$29  (via drill 0.35)
  other vias: 12.7,20.95
N$31  (via drill 0.8)
  Top 0.203: MOD1.P19 6.99,57.04 v6.99,57.78
N$32  (via drill 0.8)
  Top 0.203: MOD1.P20 9.53,57.04 v9.53,57.78
NIRQ
  Top 0.203: RF1.13 40.91,26.94 39.93,25.96 39.93,22.3 43.18,19.05 43.18,16.83 45.72,14.92 IC4.11
RADIO1_SHDN  (via drill 0.35)
  Top 0.203: v24.13,74.93 24.13,74.84 27.85,71.12 50.16,71.12 50.56,70.73 50.56,57.86 v50.48,57.78 | 54.85,55.86 54.85,47.01 v55.69,46.18 | IC4.6 44.45,18.75 44.45,17.78 | 44.45,17.78 44.45,16.83 46.35,15.56 46.35,13.97 | IC4.12 46.35,13 46.35,13.97 | 46.35,13.97 46.99,13.97 46.99,13 IC4.13 46.99,13.03 v46.99,15.24 | IC4.5 45.07,17.78 44.45,17.78 | IC2.5 46.37,43.16 v46.67,42.86 47.02,43.21 IC2.6 | v45.09,51.44 44.42,50.77 IC2.13 | v56.52,39.37 61.27,34.61 R9.2 64.57,30.48 PWR3.SHDN 66.93,27.56 66.04,26.67 66.04,21.58 66.33,21.29 68.24,21.29 68.84,20.68 68.84,18.27 52.56,18.27 v50.16,15.88
  Top 0.254: 54.85,55.86 54.85,57.71 v54.93,57.78
  Bottom 0.203: v54.93,57.78 v50.48,57.78 50.48,54.29 48.58,52.39 46.04,52.39 v45.09,51.44 44.45,50.8 44.45,48.26 46.67,46.04 v46.67,42.86 | v24.13,74.93 21.59,74.93 21.59,77.59 MOD1.P7 | v55.69,46.18 56.52,45.35 v56.52,39.37 | v46.99,15.24 47.62,15.88 v50.16,15.88
RADIO2_SHDN  (via drill 0.35)
  Top 0.203: 54.22,45.11 54.22,65.33 v54.29,65.41 | v47.62,69.85 47.62,67.63 v49.85,65.41 49.85,58.74 48.9,57.78 48.9,53.98 48.58,53.66 39.69,53.66 39.37,53.34 v39.37,50.8 | R11.2 61.39,43.93 64.52,43.93 | IC5.13 23.5,7.32 23.5,8.89 22.86,8.89 | 22.86,8.89 22.86,7.3 IC5.12 | 22.86,8.89 22.82,8.94 | 22.82,8.94 21.57,10.18 21.57,12.06 | 22.82,8.94 22.82,9.59 25.4,9.59 25.4,15.38 25.78,15.75 25.78,20.06 26.04,20.32 v26.04,20.88 | 21.57,12.06 IC5.5 | IC5.6 20.95,13.01 20.95,12.06 21.57,12.06 | IC3.5 35.56,44.1 35.56,42.89 v35.58,42.88 | v33.66,48.33 33.62,48.36 IC3.13 | IC3.6 36.23,43.21 35.89,42.88 v35.58,42.88 | v26.02,27.95 31.45,33.38 31.45,34.04 32.38,34.98 32.38,41.91 34.61,41.91 v35.58,42.88
  Top 0.254: PWR4.SHDN 67.49,34.22 66.27,35.44 66.27,36.48 66.89,37.1 68.24,37.1 68.71,37.57 68.71,41.71 66.5,43.93 64.52,43.93 | 54.22,45.11 54.24,45.09 60.96,45.09 61.27,44.77 R11.2
  Bottom 0.203: MOD1.P17 47.19,70.28 v47.62,69.85 | v49.85,65.41 v54.29,65.41 | v35.58,42.88 35.56,42.89 35.56,46.35 | 35.56,46.35 33.66,48.26 v33.66,48.33 | 35.56,46.35 37.47,46.35 39.37,48.26 v39.37,50.8 | v26.04,20.88 v26.04,27.94 v26.02,27.95
RADIO_VCC_3_3
  Top 0.203: RF1.5 42.91,23.5
  Top 0.406: C9.1 50.8,29.52 50.8,26.04
  Top 0.61: 50.8,26.04 45.72,26.04 43.18,26.04 42.91,25.77 42.91,23.5
  Top 0.813: PWR3.VOUT 56.9,19.94 55.88,20.95 50.8,26.04
RADIO_VCC_5V  (via drill 0.5, 0.8)
  Top 0.203: C11.1 54.92,40.95 54.61,40.64
  Top 0.406: C10.1 31.75,32.38
  Top 0.61: v32.38,33.02 31.75,32.38 23.18,23.81 v20.95,23.81 | v20.95,20.32 20.95,18.32 RF2.5
  Top 0.813: v50.8,33.02 50.8,33.34 54.61,33.34 54.61,40.64 55.56,40.96 PWR4.VOUT
  Bottom 0.61: v50.8,33.02 v32.38,33.02 | v20.95,23.81 v20.95,20.32
RXANT  (via drill 0.35)
  Top 0.203: RF2.3 16.8,16.37 16.85,16.32 v16.82,16.3 | IC5.4 22.23,13.97 21.08,13.97 18.74,16.32 v18.58,16.32
  Bottom 0.203: v16.82,16.3 18.58,16.3 v18.58,16.32
SCK  (via drill 0.35)
  Top 0.203: v74.3,79.06 73.66,79.06 73.34,79.38 69.53,79.38 68.26,78.11 64.14,78.11 60.33,74.3 57.78,74.3 56.52,73.03 52.39,73.03 | 52.39,73.03 34.29,73.03 33.18,74.14 33.18,78.35 32.38,79.15 31.52,79.15 30.17,77.8 MOD1.P10 | U2.4 83.45,69.15 83.85,69.15 84.55,69.85 85.09,70.48 85.09,75.56 80.64,75.56 77.15,78.74 v76.83,79.06 | IC3.1 33.02,44.16 33.02,46.35 43.81,46.35 | IC2.1 43.77,44.49 43.81,46.35 | 43.81,46.35 51.44,46.35 52.39,47.62 v52.39,69.22 | v52.39,73.34 52.39,73.03
  Bottom 0.203: v76.83,79.06 v74.3,79.06 | v52.39,69.22 v52.39,73.34
SD_SEL
  Top 0.203: U2.7 79.36,72.41 72.71,78.74 69.85,78.74 68.58,77.47 64.45,77.47 60.64,73.66 58.42,73.66 57.15,72.39 33.02,72.39 31.95,73.46 MOD1.P11
SYSTEM_RAIL_SHDN  (via drill 0.35)
  Top 0.203: v24.13,73.66 29.26,68.53 44.52,68.53 48.9,64.16 v48.9,62.87 | MOD1.P6 19.25,73.76 v19.15,73.66 | v54.93,62.87 66.41,62.87 67.38,61.89 67.38,59.8 67.49,59.69
  Top 0.406: PWR2.SHDN 67.49,59.69 R7.2
  Bottom 0.203: v54.93,62.87 v48.9,62.87 | v24.13,73.66 19.05,73.66 v19.15,73.66
SYSTEM_VCC_3.3  (via drill 0.35, 0.8)
  Top 0.203: IC3.12 34.27,49.23 34.92,48.58 v34.92,48.33
  Top 0.254: v36.83,47.06 50.24,47.06 v50.71,48.34
  Top 0.305: v57.15,48.26 60.96,48.26
  Top 0.762: 4.89,78.74 5.21,79.38 9.21,79.38 9.21,85.88
  Top 0.813: 4.89,78.74 4.89,53.84 8.89,51.43 8.89,46.35 4.45,43.18 4.45,39.45 M2.P$7 | 9.21,85.88 29.98,85.88 31.14,84.71 38.29,84.71 M1.P$4 40.37,82.63 44.18,82.63 50.92,76.2 v59.69,76.2 | 82.95,44.45 79.54,41.04 79.54,36.33 82.23,34.26 82.23,9.84 76.2,3.81 54.61,3.81 54.42,4 M2.P$4 | M1.P$7 82.95,47.95 82.95,44.45 | 82.95,44.45 v80.01,44.45 | v59.69,71.75 v59.69,64.14 | v59.69,60.33 59.69,48.26 60.96,48.26 PWR2.VOUT
  Bottom 0.254: v36.83,47.06 36.2,47.06 v34.92,48.33
  Bottom 0.305: v50.71,48.34 57.07,48.34 v57.15,48.26
  Bottom 0.813: v59.69,76.2 v59.69,71.75 | v80.01,44.45 68.76,44.45 67.49,45.72 PWR2.VOUT | v59.69,64.14 v59.69,60.33
TMP1
  Top 0.203: TMP_1.P$2 15.88,85.09 27.94,85.09 27.94,81.92 22.98,78.22 22.98,64.22 31.91,55.29 31.91,54.98 MOD1.P28
TMP2  (via drill 0.35)
  Top 0.203: MOD1.P22 14.91,53.14 12.66,53.14 11.43,51.91 11.43,35.56 12.06,34.92 v12.06,34.29 | v12.06,29.84 12.06,25.4 5.71,19.05 TMP_2.P$2
  Bottom 0.203: v12.06,34.29 v12.06,29.84
TMP3
  Top 0.203: MOD1.P23 17.02,52.7 13.97,52.7 13.82,52.55 13.82,34.14 12.7,33.02 9.3,33.02 TMP_3.2
TMP4
  Top 0.203: TMP_4.P$2 24.13,84.45 27.3,84.45 27.3,82.21 23.18,79.06 20.62,79.06 20.64,79.08 20.64,66.36 20.64,64.77 29.21,56.2 29.21,55.13 MOD1.P27
TMP_BAT
  Top 0.254: MOD1.P26 26.82,54.98 25.42,56.99 13.26,56.99 12.71,55.9 12.71,54.49 10.1,52.04 10.16,45.09 9.36,44.28 9.36,39.31 6.35,35.59 6.35,32.35
  Top 0.406: M2.P$3 6.35,32.35
TXANT
  Top 0.203: RF1.4 40.91,22.89 42.32,21.48 47.62,21.48 47.62,18.75 IC4.1
UVP_TRIG  (via drill 0.35)
  Top 0.203: MOD1.P14 39.57,76.64 40.64,75.56 48.9,75.56 v48.9,75.64
  Top 0.406: M1.P$6 58,78.11 v51.44,78.11
  Bottom 0.203: v48.9,75.64 51.12,77.86 v51.44,78.11
V_BATT  (via drill 0.35)
  Top 0.203: C3.1 R4.2 15.87,65.41 17.78,65.41 17.78,64.33 v21.79,60.33 | 45.09,66.04 47.62,63.5 v47.62,61.59
  Top 0.254: R3.1 77.47,61.59 78.11,61.59 v76.83,61.59 | v66.67,61.59 v54.93,61.59 | 45.09,66.04 25.4,66.04 24.77,65.41 v24.77,64.77
  Bottom 0.254: v54.93,61.59 v47.62,61.59 | v24.77,64.77 21.79,61.8 v21.79,60.33 MOD1.P24 | v76.83,61.59 v66.67,61.59
V_BATTERY+
  Top 0.203: R3.2 78.5,58.82 78.11,58.42
  Top 0.305: R2.1 76.43,55.75 IC1.3
  Top 0.813: R2.1 78.11,58.42 79.38,58.42 79.8,58 M1.P$3
VB+
  Top 0.305: R2.2 73.62,58.86 IC1.4
  Top 0.813: 71.12,58.42 70.48,58.42 69.22,59.69 69.22,73.41 PWR1.VIN | 71.12,58.42 R2.2 | PWR3.VIN 71.44,25.02 71.44,36.2 | 71.12,53.34 PWR2.VIN | 71.44,36.2 71.44,53.34 71.12,53.34 | 71.12,53.34 71.12,58.42 | PWR4.VIN 71.12,35.88 71.44,36.2

### Text on the board
tPlace: nSEL | nIRQ | RX-ANT | TX-ANT | SSU-EdgeStar uStar Radio | SCH Rev 2.0 | PCB Rev 2.1b
bPlace: SYS_VCC | 1WireBus | UVP_TRG | V_BAT | 1WireBus | SYS_VCC | SYS_VCC | 1WireBus | Tmp_Bat | 1WireBus | I_SOL | SYS_VCC
bNames: GND | 3.3V | TX | RX | 1W